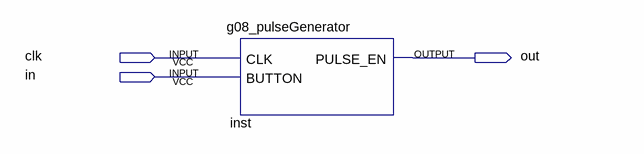
[diagram p0: schematic sheet]
// Quartus schematic pulse_gen_test.bdf as structural Verilog: 1 symbols, 3 pins
module pulse_gen_test (
  input  clk,
  input  in,
  output out
);

  g08_pulseGenerator inst (.CLK(clk), .BUTTON(in), .PULSE_EN(out));
endmodule
